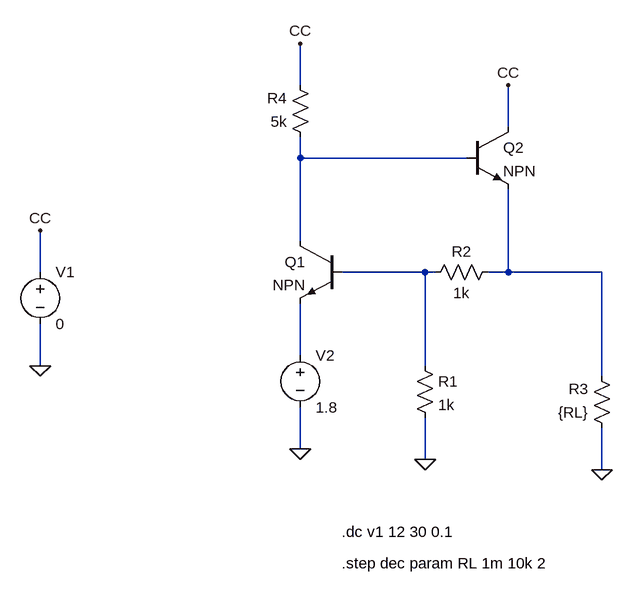
[diagram p0: schematic Regulador_Simple.asc]
Regulador_Simple.asc, the LTspice schematic file:
Version 4.1
SHEET 1 880 680
WIRE 240 -304 240 -368
WIRE 560 -240 560 -304
WIRE 240 -192 240 -224
WIRE 496 -192 240 -192
WIRE 240 -64 240 -192
WIRE -160 -16 -160 -80
WIRE 432 -16 304 -16
WIRE 448 -16 432 -16
WIRE 560 -16 560 -144
WIRE 560 -16 528 -16
WIRE 704 -16 560 -16
WIRE 240 112 240 32
WIRE -160 128 -160 64
WIRE 432 128 432 -16
WIRE 704 144 704 -16
WIRE 240 256 240 192
WIRE 432 272 432 208
WIRE 704 288 704 224
FLAG 704 288 0
FLAG 432 272 0
FLAG 240 256 0
FLAG -160 128 0
FLAG -160 -80 CC
FLAG 240 -368 CC
FLAG 560 -304 CC
SYMBOL npn 304 -64 M0
SYMATTR InstName Q1
SYMBOL npn 496 -240 R0
SYMATTR InstName Q2
SYMBOL voltage -160 -32 R0
WINDOW 123 0 0 Left 0
WINDOW 39 0 0 Left 0
SYMATTR InstName V1
SYMATTR Value 0
SYMBOL voltage 240 96 R0
WINDOW 123 0 0 Left 0
WINDOW 39 0 0 Left 0
SYMATTR InstName V2
SYMATTR Value 1.8
SYMBOL res 416 112 R0
SYMATTR InstName R1
SYMATTR Value 1k
SYMBOL res 544 -32 R90
WINDOW 0 0 56 VBottom 2
WINDOW 3 32 56 VTop 2
SYMATTR InstName R2
SYMATTR Value 1k
SYMBOL res 720 240 R180
WINDOW 0 36 76 Left 2
WINDOW 3 36 40 Left 2
SYMATTR InstName R3
SYMATTR Value {RL}
SYMBOL res 256 -208 R180
WINDOW 0 36 76 Left 2
WINDOW 3 36 40 Left 2
SYMATTR InstName R4
SYMATTR Value 5k
TEXT 304 384 Left 2 !.dc v1 12 30 0.1
TEXT 304 432 Left 2 !.step dec param RL 1m 10k 2

The netlist it stands for:
* Regulador_Simple.asc
Q1 N001 N002 N004 0 NPN
Q2 CC N001 N003 0 NPN
V1 CC 0 0
V2 N004 0 1.8
R1 N002 0 1k
R2 N003 N002 1k
R3 0 N003 {RL}
R4 N001 CC 5k
.model NPN NPN
.model PNP PNP
.lib standard.bjt
.dc v1 12 30 0.1
.step dec param RL 1m 10k 2
.backanno
.end